# EasyEDA Pro project stc8g.eprj

# Schematic Schematic1
Board Name: Board1; Create Date: 2024-12-19; Page Name: P1; Project Name: stc8g; Schematic Name: Schematic1; Update Date: 2024-12-22; Company: 嘉立创EDA; Page Size: A4; Version: V1.0
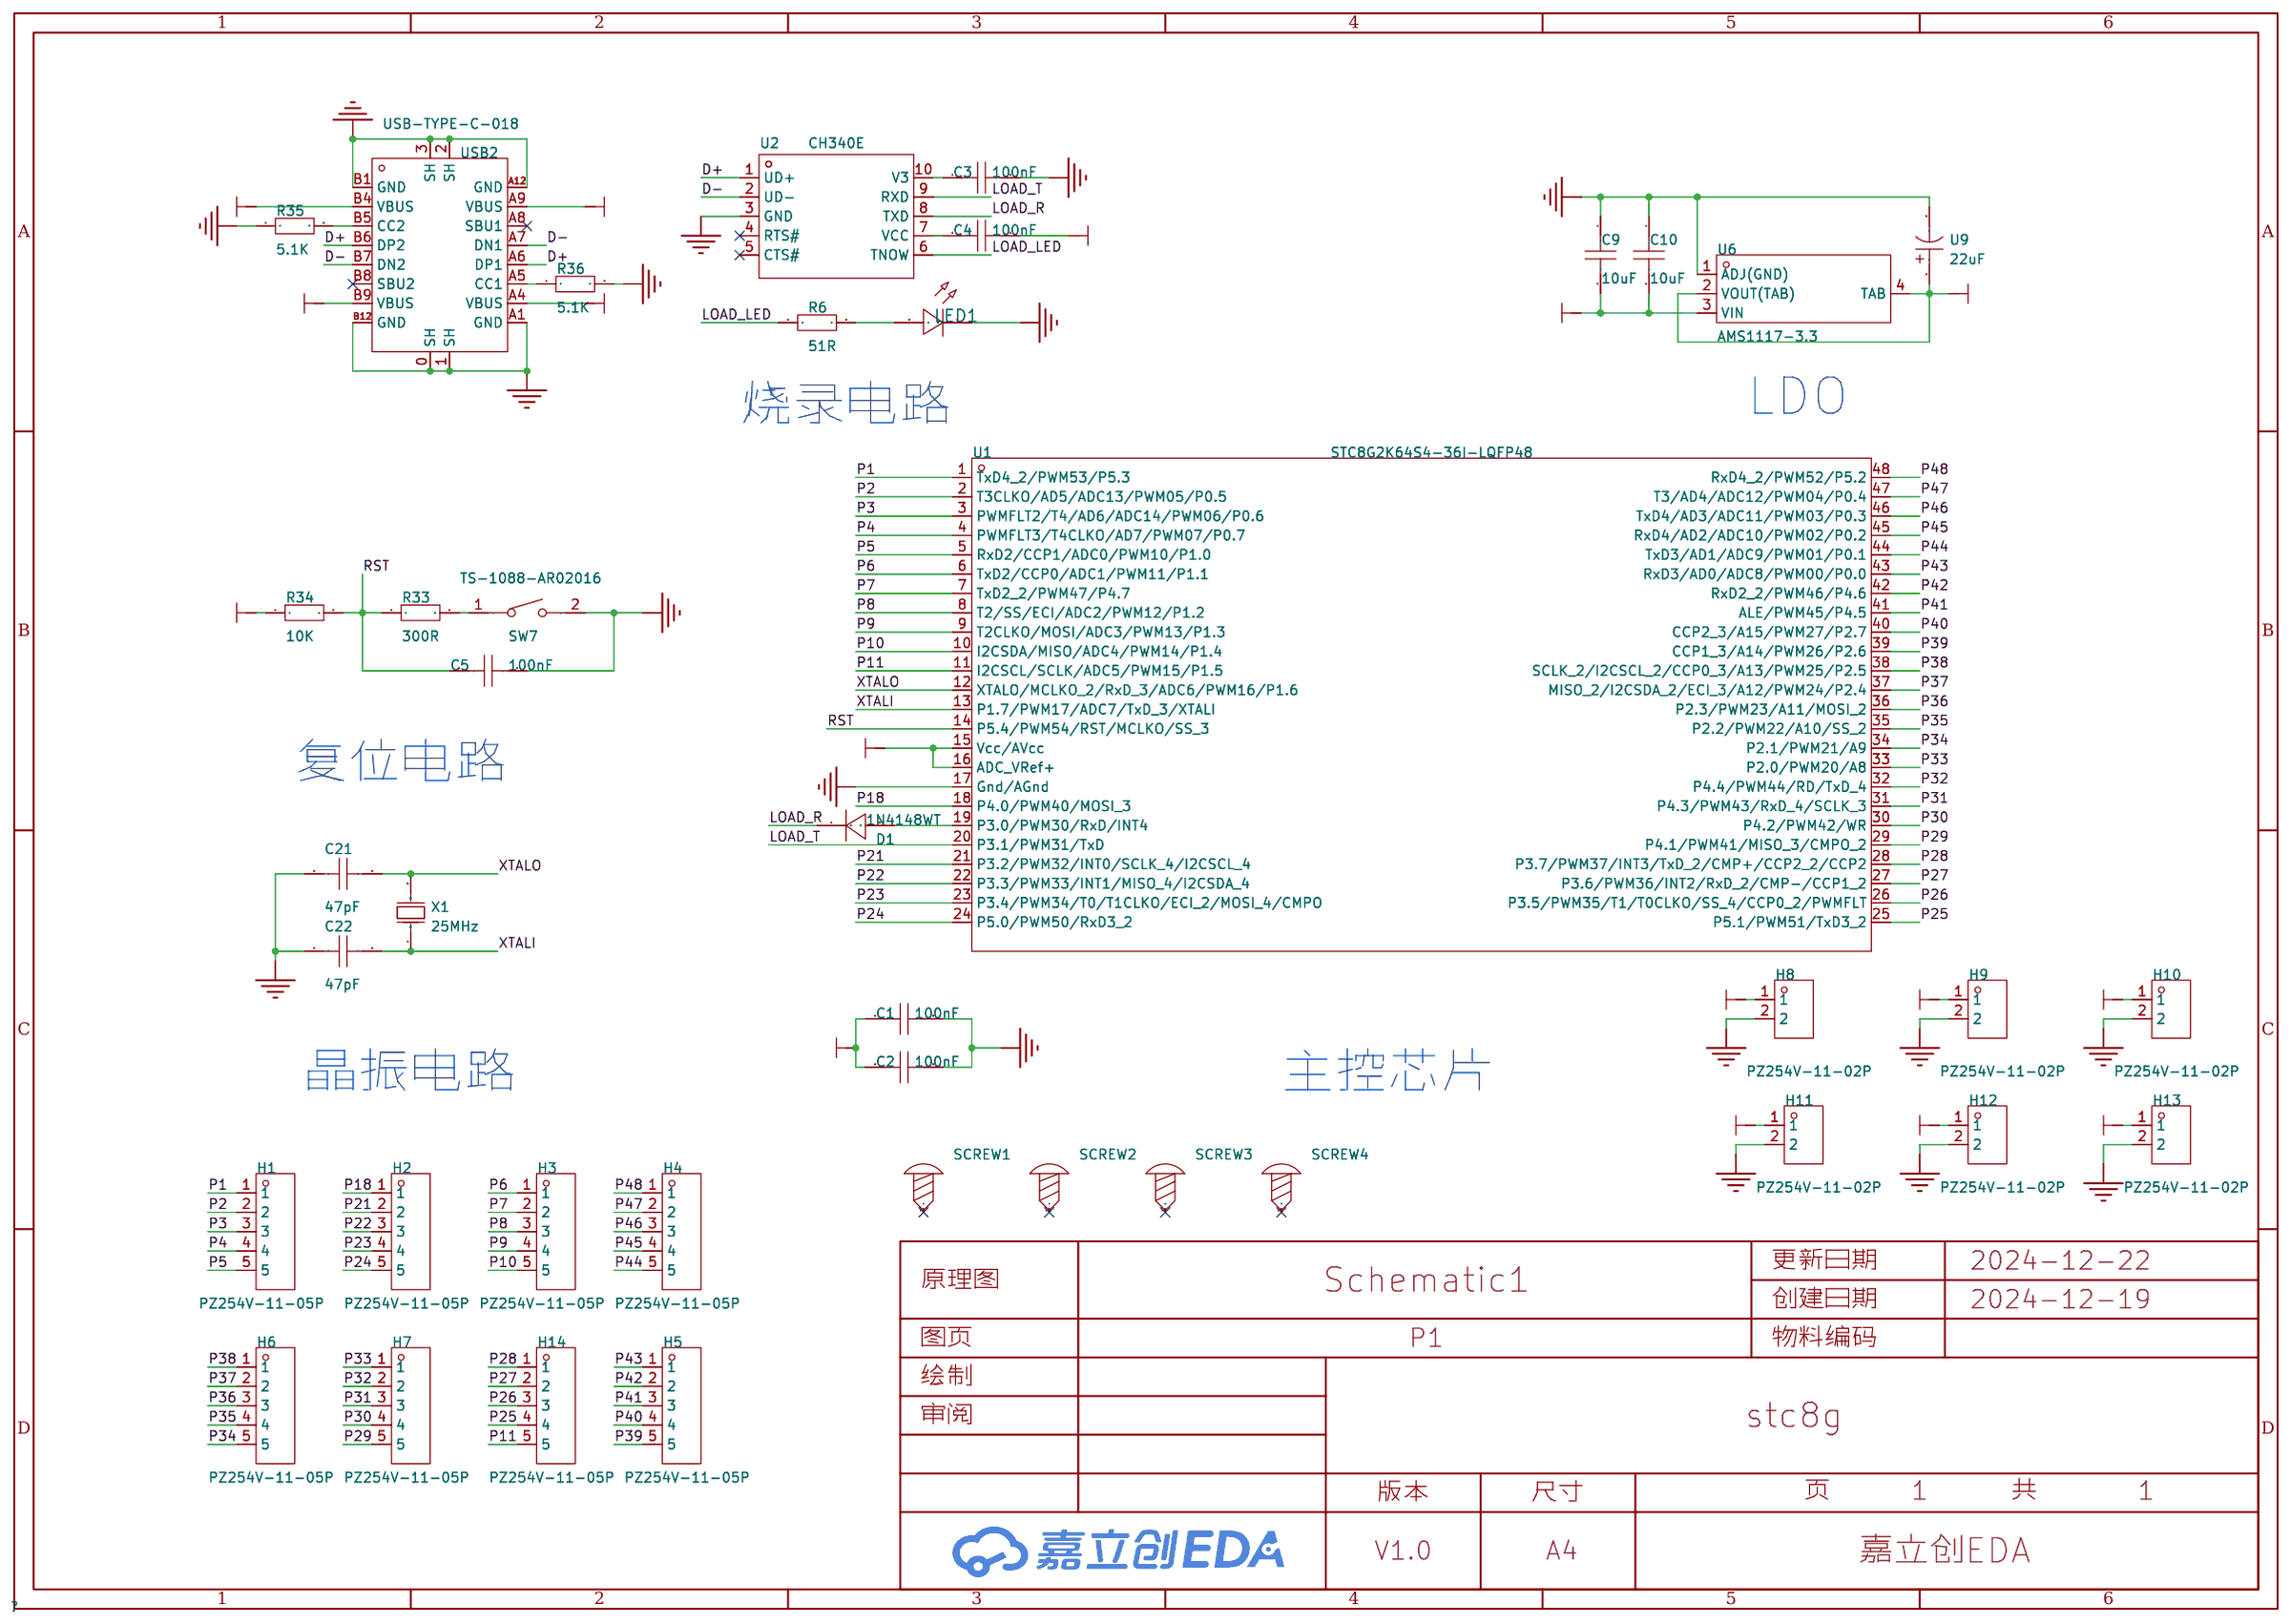
[diagram p0: schematic sheet]

## Parts
C1  100nF  [C0603]
C2  100nF  [C0603]
C3  100nF  [C0603]
C4  100nF  [C0603]
C5  100nF  [C0603]
C9  10uF  [C0603]
C10  10uF  [C0603]
C21  47pF  [C0603]
C22  47pF  [C0603]
D1  1N4148WT  [SOD-523_L1.2-W0.8-LS1.6-RD]
H1  PZ254V-11-05P  [HDR-TH_5P-P2.54-V-M]
H2  PZ254V-11-05P  [HDR-TH_5P-P2.54-V-M]
H3  PZ254V-11-05P  [HDR-TH_5P-P2.54-V-M]
H4  PZ254V-11-05P  [HDR-TH_5P-P2.54-V-M]
H5  PZ254V-11-05P  [HDR-TH_5P-P2.54-V-M]
H6  PZ254V-11-05P  [HDR-TH_5P-P2.54-V-M]
H7  PZ254V-11-05P  [HDR-TH_5P-P2.54-V-M]
H8  PZ254V-11-02P  [HDR-TH_2P-P2.54-V-M]
H9  PZ254V-11-02P  [HDR-TH_2P-P2.54-V-M]
H10  PZ254V-11-02P  [HDR-TH_2P-P2.54-V-M]
H11  PZ254V-11-02P  [HDR-TH_2P-P2.54-V-M]
H12  PZ254V-11-02P  [HDR-TH_2P-P2.54-V-M]
H13  PZ254V-11-02P  [HDR-TH_2P-P2.54-V-M]
H14  PZ254V-11-05P  [HDR-TH_5P-P2.54-V-M]
LED1  -  [LED_0603]
R6  51R  [R0603]
R33  300R  [R0603]
R34  10K  [R0603]
R35  5.1K  [R0603]
R36  5.1K  [R0603]
SCREW1  -  [M2螺丝]
SCREW2  -  [M2螺丝]
SCREW3  -  [M2螺丝]
SCREW4  -  [M2螺丝]
SW7  TS-1088-AR02016  [SW-SMD_L3.9-W3.0-P4.45]
U1  STC8G2K64S4-36I-LQFP48  [LQFP-48_L7.0-W7.0-P0.50-LS9.0-BL]
U2  CH340E  [MSOP-10_L3.0-W3.0-P0.50-LS5.0-BL]
U6  AMS1117-3.3  [SOT-223-4_L6.5-W3.5-P2.30-LS7.0-BR]
U9  22uF  [CAP-SMD_L2.0-W1.3-FD]
USB2  USB-TYPE-C-018  [USB-C_SMD-TYPE-C-31-M-12]
X1  25MHz  [CRYSTAL-SMD_2P-L5.0-W3.2]

## Library data of the parts
C1-C5 C9 C10 C21 C22 = CAP_0603: Supplier Footprint: 0603
D1 = 1N4148WT_C232841: 二极管配置:独立式;正向压降(Vf):1V@10mA;直流反向耐压(Vr):75V;平均整流电流(Io):300mA;功率:200mW;反向恢复时间(trr):4ns;; LCSC Part Name: 电压:75V 电流:300mA; Supplier Part: C232841; Manufacturer: onsemi(安森美); Supplier Footprint: SOD-523F; JLCPCB Part Class: 扩展库; Datasheet: https://atta.szlcsc.com/upload/public/pdf/source/20181222/C232841_42C5BA49E5A441BB8F6B91D0F4CD0D51.pdf; Supplier: LCSC; Diode Configuration: 独立式; Forward Voltage (Vf@If): 1V@10mA; Reverse Voltage (Vr): 75V; Average Rectified Current (Io): 300mA; Power Dissipation: 200mW; Reverse Leakage Current: 5uA@75V; Reverse Recovery Time (trr): 4ns; Operating Temperature: -55℃~+150℃@(Tj)
H1-H7 H14 = PZ254V-11-05P: LCSC Part Name: 间距:2.54mm 1x5P 直插 方针; Supplier Part: C492404; Manufacturer: XFCN(兴飞); Supplier Footprint: 插件,P=2.54mm; JLCPCB Part Class: 扩展库; Datasheet: https://atta.szlcsc.com/upload/public/pdf/source/20200309/C492404_E51533260F8710EFF5D4617281164C1D.pdf; Supplier: LCSC; Pin Structure: 1x5P; Pitch: 2.54mm; Circluar Pins/Square Pins: 方针; Mounting Type: 直插; Number of Rows: 单排; Number of Pins: 5P; Length of Mating Pin: 6mm; Insulation Height: 2.5mm; Length of End Connection Pin: 3mm; Contact Material: 黄铜; Operating Temperature Range: -40℃~+105℃; Color: 黑色
H8-H13 = PZ254V-11-02P: LCSC Part Name: 间距:2.54mm 1x2P 直插 方针; Supplier Part: C492401; Manufacturer: XFCN(兴飞); Supplier Footprint: 插件,P=2.54mm; JLCPCB Part Class: 扩展库; Datasheet: https://atta.szlcsc.com/upload/public/pdf/source/20200309/C492401_A812433581A9B211A7FFA413ADDFF0E5.pdf; Supplier: LCSC; Pin Structure: 1x2P; Pitch: 2.54mm; Circluar Pins/Square Pins: 方针; Mounting Type: 直插; Number of Rows: 单排; Number of Pins: 2P; Length of Mating Pin: 6mm; Insulation Height: 2.5mm; Length of End Connection Pin: 3mm; Contact Material: 黄铜; Operating Temperature Range: -40℃~+105℃; Color: 黑色
LED1 = LED_0603-R: Supplier Footprint: 0603
R6 R33-R36 = Res_0603: Supplier Footprint: 0603
SCREW1-SCREW4 = M2螺丝: Supplier Footprint: 插件
SW7 = TS-1088-AR02016: 电路结构:单刀单掷;按钮形状:圆形按钮;作用力:160gf;安装方式:立贴;开关长度:4mm;开关宽度:3mm;开关高度:2mm;带支架:不带;触点电流:50mA;额定电压(DC):12V;绝缘电阻:100MΩ;机械寿命:10万次;; LCSC Part Name: 4*3*2mm 立贴 轻触开关; Supplier Part: C720477; Manufacturer: XUNPU(讯普); Supplier Footprint: SMD; JLCPCB Part Class: 扩展库; Datasheet: https://atta.szlcsc.com/upload/public/pdf/source/20200810/C720475_60D09DD6C54279ADDB2DC25100F1CC11.pdf; Supplier: LCSC; Circuit: 单刀单掷; Actuator Style: 圆形按钮; Operating Force: 160gf; Mounting Style: 立贴; Switch Length: 4mm; Switch Width: 3mm; Switch Height: 2mm; Strike Gundam: 不带; Contact Current: 50mA; Voltage Rating (DC): 12V; Insulation Resistance: 100MΩ; Actuator/Cap Color: 黑色; Pin Style: SMD接片; Mechanical Life: 10万次; Operating Temperature: -30℃~+80℃
U1 = STC8G2K64S4-36I-LQFP48: CPU内核:51系列;程序存储容量:64KB;RAM总容量:2.25KB;GPIO端口数量:45;工作电压范围:1.9V~5.5V;CPU最大主频:-;程序存储器类型:FLASH;; Supplier Part: C915668; Manufacturer: STC(宏晶); Supplier Footprint: LQFP-48(7x7); JLCPCB Part Class: 扩展库; Datasheet: https://atta.szlcsc.com/upload/public/pdf/source/20230914/7707908C45C6343AE73767C1466DDB8D.pdf; Supplier: LCSC; CPU Core: 51系列; Program Storage Size: 64KB; RAM Size: 2.25KB; GPIO Ports Number: 45; Operating Voltage Range: 1.9V~5.5V; Program Memory Type: FLASH; Operating Temperature Range: -40℃~+85℃; ADC (Bit): 10bit; PWM (Bit): 15bit; 16Bit Timer: 5; UART/USART: 4; I2C: 1; SPI: 1; Internal Comparator: 有; Peripheral/Function: 低电压检测；看门狗；CCP捕获/比较；除法器；乘法器; Watchdog: 有; Low-Voltage Detect: 有; CCP Capture/Compare: 有; Internal Oscillator: 有
U2 = CH340E: 应用功能:收发器;接口协议:USB 2.0;数据速率:2Mbps;; LCSC Part Name: USB转串口芯片 CH340; Supplier Part: C99652; Manufacturer: WCH(南京沁恒); Supplier Footprint: MSOP-10; JLCPCB Part Class: 扩展库; Datasheet: https://atta.szlcsc.com/upload/public/pdf/source/20230530/6E401E9554E9F5311886CC8B3F89B62E.pdf; Supplier: LCSC; Applications Function: 收发器; Protocol: USB 2.0; Supply Voltage: 3.3V；5V; Data Rate: 2Mbps
U6 = AMS1117-3.3_C347222: 输出类型:固定;最大输入电压:18V;输出电压:3.3V;输出电流:1A;电源纹波抑制比(PSRR):60dB@(120Hz);输出极性:正极;; LCSC Part Name: 输出:3.3V 电流:1A 耐压:12V; Supplier Part: C347222; Manufacturer: UMW(友台半导体); Supplier Footprint: SOT-223; JLCPCB Part Class: 扩展库; Datasheet: https://atta.szlcsc.com/upload/public/pdf/source/20231109/155D79A26D9DB04352555A58D5969DC8.pdf; Supplier: LCSC; Output Type: 固定; Maximum Input Voltage: 18V; Output Voltage: 3.3V; Output Current: 1A; Power Supply Rejection Ratio (PSRR): 60dB@(120Hz); Dropout Voltage: 1.3V@(1A); Feature: 过流保护(OCP); Output Polarity: 正极; Number of Outputs: 1
U9 = TMCP0J226MTRF: 容值:22uF;精度:±20%;额定电压:6.3V;等效串联电阻:5.9Ω@100kHz;; LCSC Part Name: 22uF ±20% 6.3V; Supplier Part: C4983891; Manufacturer: VISHAY(威世); Supplier Footprint: 0805; JLCPCB Part Class: 扩展库; Datasheet: https://atta.szlcsc.com/upload/public/pdf/source/20231213/45DEC9D623A3BCD604D80B89FE3D1B4C.pdf; Supplier: LCSC; Tolerance: ±20%; Rated Voltage: 6.3V; Equivalent Series Resistance(ESR): 5.9Ω@100kHz; Operating Temperature: -55℃~+125℃
USB2 = USB-TYPE-C-018: 连接器类型:Type-C;标准:-;公母:母;安装方式:卧贴;触点数量:16P;端口数量:1;额定电流 - 电源:3A;工作温度范围:-25℃~+85℃;; LCSC Part Name: Type-C 母 卧贴; Supplier Part: C2927038; Manufacturer: DEALON(德艺隆); Supplier Footprint: SMD; JLCPCB Part Class: 扩展库; Datasheet: https://atta.szlcsc.com/upload/public/pdf/source/20211217/CCD3D517E355E8E0CC52ABD8D5784AD8.pdf; Supplier: LCSC; Connector Type: Type-C; Gender: 母; Mounting Style: 卧贴; Number of Contacts: 16P; Number of Ports: 1; Current Rating - Power (Max): 3A; Operating Temperature Range: -25℃~+85℃
X1 = XG1EL89CSI-111YLC-25M: 晶振类型:贴片晶振;频率:25MHz;常温频差:±10ppm;外接负载电容:20pF;频率稳定度(全温):±20ppm;; LCSC Part Name: 25MHz ±10ppm 20pF; Supplier Part: C7471626; Manufacturer: YXC(扬兴晶振); Supplier Footprint: SMD5032; JLCPCB Part Class: 扩展库; Datasheet: https://atta.szlcsc.com/upload/public/pdf/source/20240329/44922B0AF7B60E58E9B66993B6077277.pdf; Supplier: LCSC; Crystal Type: 贴片晶振; Normal temperature Frequency Tolerance: ±10ppm; External load capacitor: 20pF; Frequency Stability(Full temperature range): ±20ppm; Operating Temperature: -40℃~+85℃

## Nets
3V3: C1.1 C2.1 H8.1 H9.1 H10.1 H11.1 H12.1 H13.1 R34.1 U1.15(Vcc/AVcc) U1.16(ADC_VRef+) U6.2(VOUT(TAB)) U6.4(TAB) U9.1
GND: C1.2 C2.2 C3.2 C5.1 C9.1 C10.1 C21.1 C22.1 H8.2 H9.2 H10.2 H11.2 H12.2 H13.2 LED1.1(C) R35.1 R36.2 SW7.2 U1.17(Gnd/AGnd) U2.3(GND) U6.1(ADJ(GND)) U9.2 USB2.0(SH) USB2.1(SH) USB2.2(SH) USB2.3(SH) USB2.A1(GND) USB2.A12(GND) USB2.B1(GND) USB2.B12(GND)
VBUS: C4.1 C9.2 C10.2 U6.3(VIN) USB2.A4(VBUS) USB2.A9(VBUS) USB2.B4(VBUS) USB2.B9(VBUS)
D+: U2.1(UD+) USB2.A6(DP1) USB2.B6(DP2)
D-: U2.2(UD-) USB2.A7(DN1) USB2.B7(DN2)
LOAD_LED: R6.1 U2.6(TNOW)
LOAD_R: D1.1(C) U2.8(TXD)
LOAD_T: U1.20(P3.1/PWM31/TxD) U2.9(RXD)
P1: H1.1 U1.1(TxD4_2/PWM53/P5.3)
P2: H1.2 U1.2(T3CLKO/AD5/ADC13/PWM05/P0.5)
P3: H1.3 U1.3(PWMFLT2/T4/AD6/ADC14/PWM06/P0.6)
P4: H1.4 U1.4(PWMFLT3/T4CLKO/AD7/PWM07/P0.7)
P5: H1.5 U1.5(RxD2/CCP1/ADC0/PWM10/P1.0)
P6: H3.1 U1.6(TxD2/CCP0/ADC1/PWM11/P1.1)
P7: H3.2 U1.7(TxD2_2/PWM47/P4.7)
P8: H3.3 U1.8(T2/SS/ECI/ADC2/PWM12/P1.2)
P9: H3.4 U1.9(T2CLKO/MOSI/ADC3/PWM13/P1.3)
P10: H3.5 U1.10(I2CSDA/MISO/ADC4/PWM14/P1.4)
P11: H14.5 U1.11(I2CSCL/SCLK/ADC5/PWM15/P1.5)
P18: H2.1 U1.18(P4.0/PWM40/MOSI_3)
P21: H2.2 U1.21(P3.2/PWM32/INT0/SCLK_4/I2CSCL_4)
P22: H2.3 U1.22(P3.3/PWM33/INT1/MISO_4/I2CSDA_4)
P23: H2.4 U1.23(P3.4/PWM34/T0/T1CLKO/ECI_2/MOSI_4/CMPO)
P24: H2.5 U1.24(P5.0/PWM50/RxD3_2)
P25: H14.4 U1.25(P5.1/PWM51/TxD3_2)
P26: H14.3 U1.26(P3.5/PWM35/T1/T0CLKO/SS_4/CCP0_2/PWMFLT)
P27: H14.2 U1.27(P3.6/PWM36/INT2/RxD_2/CMP-/CCP1_2)
P28: H14.1 U1.28(P3.7/PWM37/INT3/TxD_2/CMP+/CCP2_2/CCP2)
P29: H7.5 U1.29(P4.1/PWM41/MISO_3/CMPO_2)
P30: H7.4 U1.30(P4.2/PWM42/WR)
P31: H7.3 U1.31(P4.3/PWM43/RxD_4/SCLK_3)
P32: H7.2 U1.32(P4.4/PWM44/RD/TxD_4)
P33: H7.1 U1.33(P2.0/PWM20/A8)
P34: H6.5 U1.34(P2.1/PWM21/A9)
P35: H6.4 U1.35(P2.2/PWM22/A10/SS_2)
P36: H6.3 U1.36(P2.3/PWM23/A11/MOSI_2)
P37: H6.2 U1.37(MISO_2/I2CSDA_2/ECI_3/A12/PWM24/P2.4)
P38: H6.1 U1.38(SCLK_2/I2CSCL_2/CCP0_3/A13/PWM25/P2.5)
P39: H5.5 U1.39(CCP1_3/A14/PWM26/P2.6)
P40: H5.4 U1.40(CCP2_3/A15/PWM27/P2.7)
P41: H5.3 U1.41(ALE/PWM45/P4.5)
P42: H5.2 U1.42(RxD2_2/PWM46/P4.6)
P43: H5.1 U1.43(RxD3/AD0/ADC8/PWM00/P0.0)
P44: H4.5 U1.44(TxD3/AD1/ADC9/PWM01/P0.1)
P45: H4.4 U1.45(RxD4/AD2/ADC10/PWM02/P0.2)
P46: H4.3 U1.46(TxD4/AD3/ADC11/PWM03/P0.3)
P47: H4.2 U1.47(T3/AD4/ADC12/PWM04/P0.4)
P48: H4.1 U1.48(RxD4_2/PWM52/P5.2)
RST: C5.2 R33.1 R34.2 U1.14(P5.4/PWM54/RST/MCLKO/SS_3)
XTALI: C22.2 U1.13(P1.7/PWM17/ADC7/TxD_3/XTALI) X1.1(OSC1)
XTALO: C21.2 U1.12(XTALO/MCLKO_2/RxD_3/ADC6/PWM16/P1.6) X1.2(OSC2)
$1N465: D1.2(A) U1.19(P3.0/PWM30/RxD/INT4)
$1N938: R33.2 SW7.1
$1N1407: C3.1 U2.10(V3)
$1N1408: C4.2 U2.7(VCC)
$1N1412: LED1.2(A) R6.2
$1N1428: R36.1 USB2.A5(CC1)
$1N1430: R35.2 USB2.B5(CC2)

Not connected (* = marked no-connect by the designer): SCREW1 1*; SCREW2 1*; SCREW3 1*; SCREW4 1*; U2 4(RTS#)* 5(CTS#)*; USB2 A8(SBU1)* B8(SBU2)*

## Notes on the sheet
- 烧录电路
- LDO
- 复位电路
- 晶振电路
- 主控芯片

# Board PCB1
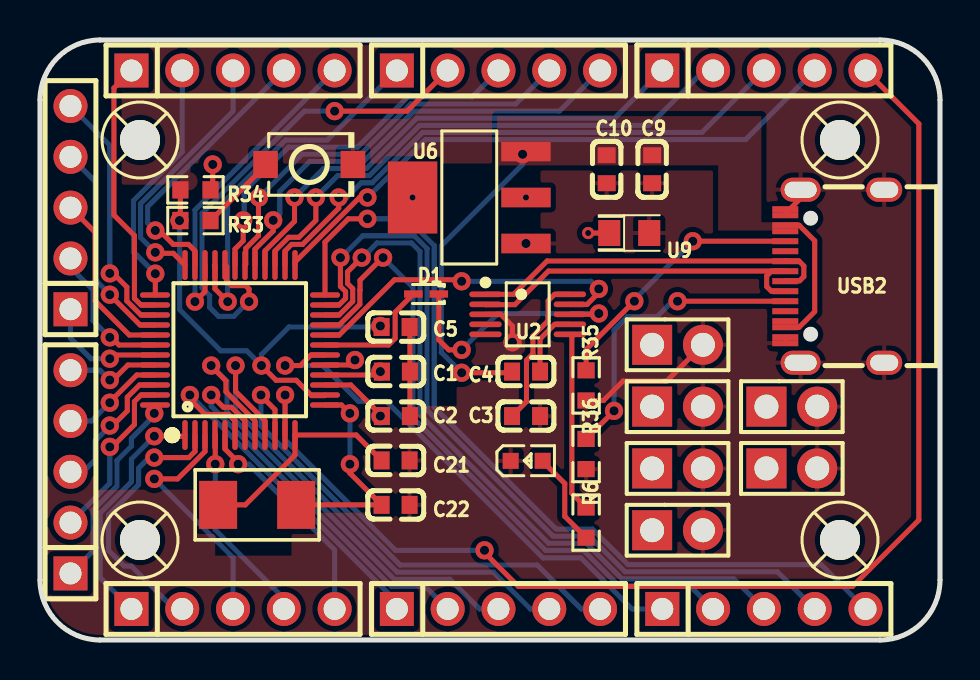
[diagram p1: board, top side]
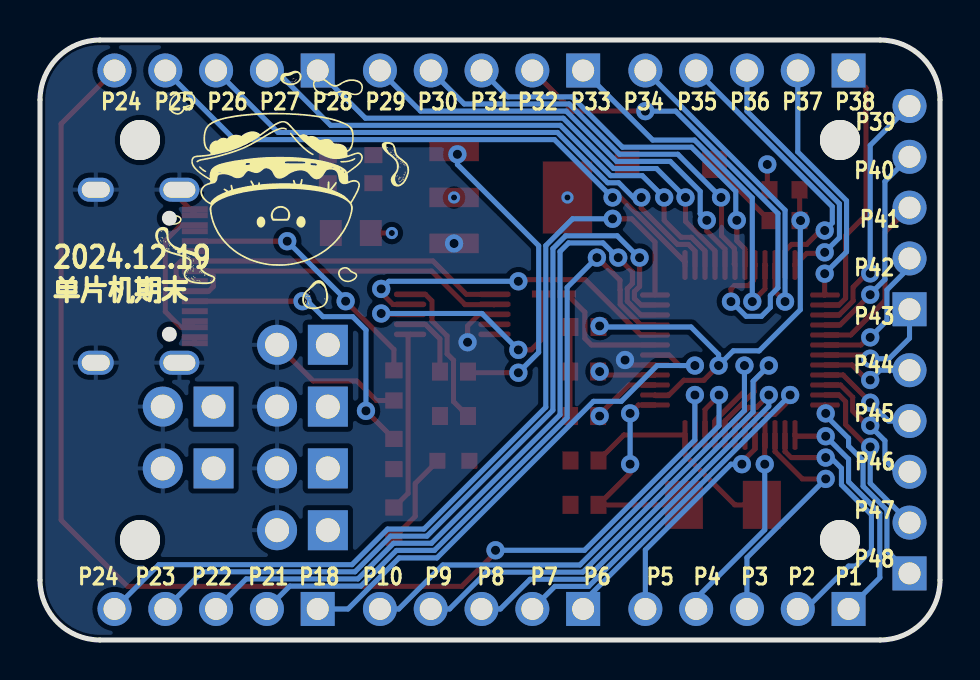
[diagram p2: board, bottom side, seen from below]

Outline 45 x 30 mm; copper layers: Top Layer, Inner1, Inner2, Bottom Layer. Coordinates in mm from the lower left corner of the outline.
Outline path: 0,27 0,3 arc(0.88,0.88) 3,0 42,0 arc(44.12,0.88) 45,3 45,27 arc(44.12,29.12) 42,30 3,30 arc(0.88,29.12) 0,27
Stack: Top Layer 0.035mm 外层铜厚1oz / Dielectric1 0.2104mm 7628 RC49% 8.6mil / Inner1 0.0152mm 内层铜厚 / Dielectric2 1.065mm 1.1mm H/HOZ Copper / Inner2 0.0152mm 内层铜厚 / Dielectric3 0.2104mm 7628 RC49% 8.6mil / Bottom Layer 0.035mm 外层铜厚1oz

## Design rules (mm)
net D+: DP1
net D-: DP1
template: JLCPCB Capability(Two Layers Board)
spacing copperThickness1oz (default): track to track 0.102, other pairs 0.152 to 0.3
spacing copperThickness2oz: track to track 0.203, other pairs 0.152 to 0.3
track width copperThickness1oz (default): min 0.127, default 0.254, max 2.54
track width copperThickness2oz: min 0.203, default 0.254, max 2.54
differential pair differentialPair (default): width min 0.127, default 0.254, max 2.54; gap min 0.152, default 0.152
via viaSize (default): diameter min 0.5, default 0.61, max 10; hole min 0.3, default 0.305, max 6.3

## Placement (name value [footprint] x y rotation side)
C1  100nF  [C0603]  17.8 13.42 0 top
C2  100nF  [C0603]  17.8 11.2 0 top
C3  100nF  [C0603]  24.3 11.2 0 top
C4  100nF  [C0603]  24.3 13.42 0 top
C5  100nF  [C0603]  17.78 15.65 180 top
C9  10uF  [C0603]  30.61 23.54 90 top
C10  10uF  [C0603]  28.34 23.54 90 top
C21  47pF  [C0603]  17.78 8.98 180 top
C22  47pF  [C0603]  17.78 6.76 180 top
D1  1N4148WT  [SOD-523_L1.2-W0.8-LS1.6-RD]  19.3 17.3 180 top
H1  PZ254V-11-05P  [HDR-TH_5P-P2.54-V-M]  9.65 1.55 0 top
H2  PZ254V-11-05P  [HDR-TH_5P-P2.54-V-M]  36.19 1.55 0 top
H3  PZ254V-11-05P  [HDR-TH_5P-P2.54-V-M]  22.92 1.55 0 top
H4  PZ254V-11-05P  [HDR-TH_5P-P2.54-V-M]  1.52 8.41 90 top
H5  PZ254V-11-05P  [HDR-TH_5P-P2.54-V-M]  1.52 21.62 90 top
H6  PZ254V-11-05P  [HDR-TH_5P-P2.54-V-M]  9.65 28.48 0 top
H7  PZ254V-11-05P  [HDR-TH_5P-P2.54-V-M]  22.92 28.48 0 top
H8  PZ254V-11-02P  [HDR-TH_2P-P2.54-V-M]  31.88 5.49 0 top
H9  PZ254V-11-02P  [HDR-TH_2P-P2.54-V-M]  31.88 11.67 0 top
H10  PZ254V-11-02P  [HDR-TH_2P-P2.54-V-M]  31.88 8.58 0 top
H11  PZ254V-11-02P  [HDR-TH_2P-P2.54-V-M]  31.88 14.76 0 top
H12  PZ254V-11-02P  [HDR-TH_2P-P2.54-V-M]  37.59 8.58 0 top
H13  PZ254V-11-02P  [HDR-TH_2P-P2.54-V-M]  37.59 11.67 0 top
H14  PZ254V-11-05P  [HDR-TH_5P-P2.54-V-M]  36.19 28.48 0 top
LED1  -  [LED_0603]  24.38 8.97 0 top
R6  51R  [R0603]  27.31 5.87 270 top
R33  300R  [R0603]  7.77 20.97 0 top
R34  10K  [R0603]  7.77 22.51 180 top
R35  5.1K  [R0603]  27.31 12.73 90 top
R36  5.1K  [R0603]  27.31 9.3 270 top
SCREW1  -  [M2螺丝]  5 25 0 top
SCREW2  -  [M2螺丝]  5 5 0 top
SCREW3  -  [M2螺丝]  40 25 0 top
SCREW4  -  [M2螺丝]  40 5 0 top
SW7  TS-1088-AR02016  [SW-SMD_L3.9-W3.0-P4.45]  13.46 23.78 0 top
U1  STC8G2K64S4-36I-LQFP48  [LQFP-48_L7.0-W7.0-P0.50-LS9.0-BL]  10 14.5 0 top
U2  CH340E  [MSOP-10_L3.0-W3.0-P0.50-LS5.0-BL]  24.38 16.28 270 top
U6  AMS1117-3.3  [SOT-223-4_L6.5-W3.5-P2.30-LS7.0-BR]  21.46 22.13 0 top
U9  22uF  [CAP-SMD_L2.0-W1.3-FD]  29.46 20.35 0 top
USB2  USB-TYPE-C-018  [USB-C_SMD-TYPE-C-31-M-12]  39.74 18.19 90 top
X1  25MHz  [CRYSTAL-SMD_2P-L5.0-W3.2]  10.86 6.76 180 top

## Footprints (pads in the part's own frame, mm; a bottom-side part is the same pattern mirrored in y, then rotated)
C0603
  rect 0.8x0.9 smd: 1(-0.7,0) 2(0.7,0)
CAP-SMD_L2.0-W1.3-FD
  rect 1.1x1.3 smd: 1(-1,0) 2(1,0)
CRYSTAL-SMD_2P-L5.0-W3.2
  rect 1.9x2.4 smd: 1(-1.95,0) 2(1.95,0)
HDR-TH_2P-P2.54-V-M
  rect 2x2 hole 1.2: 1(-1.27,0)
  round 2 hole 1.2: 2(1.27,0)
HDR-TH_5P-P2.54-V-M
  rect 1.7x1.7 hole 1.1: 1(-5.08,0)
  round 1.7 hole 1.1: 2(-2.54,0) 3(0,0) 4(2.54,0) 5(5.08,0)
LED_0603
  rect 0.8x0.8 smd: 1(-0.851,-0.01) 2(0.75,-0.005)
LQFP-48_L7.0-W7.0-P0.50-LS9.0-BL
  oval 0.27x1.5 smd: 1(-2.75,-4.25) 2(-2.25,-4.25) 3(-1.75,-4.25) 4(-1.25,-4.25) 5(-0.75,-4.25) 6(-0.25,-4.25) 7(0.25,-4.25) 8(0.75,-4.25) 9(1.25,-4.25) 10(1.75,-4.25) 11(2.25,-4.25) 12(2.75,-4.25) 25(2.75,4.25) 26(2.25,4.25) 27(1.75,4.25) 28(1.25,4.25) 29(0.75,4.25) 30(0.25,4.25) 31(-0.25,4.25) 32(-0.75,4.25) 33(-1.25,4.25) 34(-1.75,4.25) 35(-2.25,4.25) 36(-2.75,4.25)
  oval 1.5x0.27 smd: 13(4.25,-2.75) 14(4.25,-2.25) 15(4.25,-1.75) 16(4.25,-1.25) 17(4.25,-0.75) 18(4.25,-0.25) 19(4.25,0.25) 20(4.25,0.75) 21(4.25,1.25) 22(4.25,1.75) 23(4.25,2.25) 24(4.25,2.75) 37(-4.25,2.75) 38(-4.25,2.25) 39(-4.25,1.75) 40(-4.25,1.25) 41(-4.25,0.75) 42(-4.25,0.25) 43(-4.25,-0.25) 44(-4.25,-0.75) 45(-4.25,-1.25) 46(-4.25,-1.75) 47(-4.25,-2.25) 48(-4.25,-2.75)
M2螺丝
  round 2 hole 2: 1(0,0)
MSOP-10_L3.0-W3.0-P0.50-LS5.0-BL
  oval 0.28x1.62 smd: 1(-1,-2.11) 2(-0.5,-2.11) 3(0,-2.11) 4(0.5,-2.11) 5(1,-2.11) 6(1,2.11) 7(0.5,2.11) 8(0,2.11) 9(-0.5,2.11) 10(-1,2.11)
R0603
  rect 0.806x0.864 smd: 1(-0.753,0) 2(0.753,0)
SOD-523_L1.2-W0.8-LS1.6-RD
  rect 0.93x0.36 smd: 1(-0.635,0) 2(0.635,0)
SOT-223-4_L6.5-W3.5-P2.30-LS7.0-BR
  rect 2.47x0.98 smd: 1(2.835,-2.3) 2(2.835,0) 3(2.835,2.3)
  rect 2.47x3.6 smd: 4(-2.835,0)
SW-SMD_L3.9-W3.0-P4.45
  rect 1.23x1.36 smd: 1(-2.185,0) 2(2.185,0)
USB-C_SMD-TYPE-C-31-M-12
  oval 1.2x2 hole 0.8x1.6: 0(-4.325,1.706) 1(4.325,1.706)
  oval 1.2x1.8 hole 0.8x1.4: 2(4.325,-2.474) 3(-4.325,-2.474)
  rect 0.3x1.3 smd: A1(-3.35,2.474) A4(-2.55,2.474) A5(-1.25,2.474) A6(-0.25,2.474) A7(0.25,2.474) A8(1.25,2.474) A9(2.55,2.474) A12(3.35,2.474) B1(3.05,2.474) B4(2.25,2.474) B5(1.75,2.474) B6(0.75,2.474) B7(-0.75,2.474) B8(-1.75,2.474) B9(-2.25,2.474) B12(-3.05,2.474)

## Nets
As in the schematic.

Pads without a net: SCREW1 1; SCREW2 1; SCREW3 1; SCREW4 1; U2 4 5; USB2 A8 B8

## Via types
v1: diameter 0.914, hole 0.457, Top Layer to Bottom Layer, 61 vias
v2: diameter 0.61, hole 0.305, Top Layer to Bottom Layer, 3 vias

## Routing (per net, layer and track width the routed paths; a pad name or vN(x,y) marks a point on that pad's centre or on a via; arc(x,y) is an arc through that point)
3V3: length 8.8
  Top Layer w0.254: U1.16 16.93,13.25 C1.1 ; R34.1 8.64,22.62 v1(8.64,23.78) ; U9.1 v2(27.41,20.35) ; U1.15 15.54,12.75 C2.1
  vias: v1(17.02,13.42) v1(17.02,11.2) v2(18.63,22.13) v2(24.3,22.13)
GND: length 17.3
  Top Layer w0.254: v1(23.62,14.89) 23.62,15.7 23.04,16.28 U2.3 ; C2.2 C1.2 18.5,15.63 C5.1 ; U1.17 15.5,13.75 v1(15.75,14) ; R35.1 28.18,11.97 29.15,12.95 31.34,12.95 H11.2 ; USB2.1 38.03,22.08 37.26,21.32 ; USB2.B12 USB2.A1
  vias: v1(24.3,19.83)
VBUS: length 22.7
  Top Layer w0.254: v1(21.08,13.36) 23.54,13.36 C4.1 ; USB2.A4 37.96,15.64 38.74,16.42 38.74,19.96 37.96,20.74 37.26,20.74
  Bottom Layer w0.254: v1(21.08,13.36) 20.07,14.38 20.07,19.71 24.13,23.78 v1(24.13,24.28)
D+: length 18.3
  Top Layer w0.254: USB2.A6 37.29,17.96 37.98,17.96 38.19,18.17 38.19,18.7 37.95,18.95 37.28,18.95 USB2.B6 37.25,18.95 25.35,18.95 23.69,17.28 U2.1
D-: length 18.3
  Top Layer w0.254: U2.2 22.29,16.77 23.74,16.77 25.42,18.45 37.09,18.45 37.09,18.44 ; 37.09,18.44 37.26,18.44 USB2.A7 37.09,18.44 37.09,18.44 ; 37.09,18.44 36.57,18.44 36.33,18.2 36.33,17.67 36.57,17.44 USB2.B7
LOAD_LED: length 9
  Top Layer w0.254: R6.1 26.59,7.33 26.59,15.18 U2.6
LOAD_R: length 12.7
  Top Layer w0.254: v1(27.94,16.33) 27.9,16.28 U2.8 ; v1(21.08,14.51) 20.44,14.51 19.94,15.01 D1.1
  Bottom Layer w0.254: v1(27.94,16.33) 22.9,16.33 v1(21.08,14.51)
LOAD_T: length 16.9
  Top Layer w0.254: v1(27.94,17.55) 27.94,17.37 27.35,16.78 26.5,16.78 U2.9 ; v1(21.08,17.94) 21,18.01 17.72,18.01 14.96,15.25 U1.20
  Bottom Layer w0.254: v1(27.94,17.55) 27.56,17.94 v1(21.08,17.94)
P1: length 12
  Top Layer w0.254: U1.1 7.19,10.19 v1(5.72,10.19)
  Bottom Layer w0.254: v1(5.72,10.19) 4.57,9.05 4.57,7.91 3.01,6.35 3.01,3.11 H1.1
P2: length 13.6
  Top Layer w0.254: v1(5.72,9.12) 7.44,9.12 7.75,9.43 U1.2
  Bottom Layer w0.254: v1(5.72,9.12) 5.46,9.12 4.93,8.59 4.93,7.76 3.43,6.26 3.43,4.48 4.21,3.7 4.57,3.7 6.71,1.55 H1.2
P3: length 12.1
  Top Layer w0.254: U1.3 8.25,9.43 6.88,8.06 v1(5.72,8.06)
  Bottom Layer w0.254: H1.3 9.65,4.12 v1(5.72,8.06)
P4: length 10.1
  Top Layer w0.254: v1(8.76,8.79) 8.76,10.24 U1.4
  Bottom Layer w0.254: H1.4 12.19,2.08 8.76,5.51 v1(8.76,8.79)
P5: length 11.3
  Top Layer w0.254: v1(9.91,8.79) 9.91,8.89 9.25,9.55 U1.5
  Bottom Layer w0.254: v1(9.91,8.79) 10.45,8.79 14.73,4.51 H1.5
P6: length 18.4
  Top Layer w0.254: U1.6 9.75,10.95 9.42,11.28 8.25,11.28 7.57,11.97 7.49,11.97
  Bottom Layer w0.254: H3.1 17.84,1.9 v1(7.49,12.25)
P7: length 19.5
  Top Layer w0.254: U1.7 10.25,10.95 9.57,11.64 9.17,11.64 v1(8.56,12.25)
  Bottom Layer w0.254: H3.2 19.25,2.68 17.57,2.68 8.56,11.69 v1(8.56,12.25)
P8: length 24.6
  Top Layer w0.254: 8.58,13.65 8.61,13.65 9.3,12.96 9.3,12.41 10.75,10.96 U1.8
  Bottom Layer w0.254: H3.3 21.98,1.55 20.5,3.04 17.71,3.04 9.34,11.41 9.34,12.94 v1(8.56,13.72)
P9: length 26.1
  Top Layer w0.254: 9.78,13.65 9.78,12.43 11.25,10.96 U1.9
  Bottom Layer w0.254: H3.4 24.52,1.55 22.68,3.39 17.86,3.39 9.78,11.48 v1(9.78,13.72)
P10: length 24.6
  Top Layer w0.254: U1.10 11.75,11.52 11.05,12.22 v1(11.05,12.25)
  Bottom Layer w0.254: H3.5 27.06,1.55 24.86,3.75 18.01,3.75 11.05,10.71 v1(11.05,12.25)
P11: length 63.9
  Top Layer w0.254: v1(22.22,4.48) 22.22,4.37 23.91,2.68 40.63,2.68 43.94,6 43.94,25.81 H14.5 ; U1.11 12.25,12.18
  Bottom Layer w0.254: v1(12.26,12.25) 12.26,12.25 12.26,10 17.78,4.48 v1(22.22,4.48)
P18: length 26.1
  Top Layer w0.254: U1.18 13.55,14.25 13.02,13.72 v1(12.26,13.72)
  Bottom Layer w0.254: 31.12,1.55 29.6,1.55 27.05,4.11 25.15,4.11 17.32,11.93 15.93,11.93 14.14,13.72 v1(12.26,13.72)
P21: length 32.6
  Top Layer w0.254: U1.21 14.96,15.75 15.99,16.78 15.99,17.49 16,17.5 16,17.99 17.13,19.12 v1(17.15,19.12)
  Bottom Layer w0.254: H2.2 32.51,2.7 28.96,2.7 27.18,4.48 25.28,4.48 18.64,11.12 18.64,17.63 v1(17.15,19.12)
P22: length 37
  Top Layer w0.254: U1.22 14.95,16.25 15.63,16.93 15.63,17.57 15.38,17.83 15.38,18.41 v1(16.09,19.12)
  Bottom Layer w0.254: 16.09,19.25 16.32,19.25 16.42,19.35 16.42,19.42 16.85,19.85 18.57,19.85 19,19.42 19,11.26 25.43,4.84 27.32,4.84 29.11,3.05 34.69,3.05 H2.3
P23: length 40.1
  Top Layer w0.254: 15.02,19.25 15.02,17.68 15.28,17.42 15.28,17.08 14.95,16.75 U1.23
  Bottom Layer w0.254: 38.74,1.55 36.88,3.41 29.25,3.41 27.47,5.19 25.65,5.19 19.35,11.49 19.35,19.57 18.72,20.21 16.14,20.21 15.05,19.12 v1(15.02,19.12)
P24: length 42.7
  Top Layer w0.254: 16.13,21.06 15.41,21.06 14.25,19.9 U1.24
  Bottom Layer w0.254: H2.5 39.06,3.77 29.4,3.77 27.62,5.55 25.8,5.55 19.71,11.64 19.71,19.72 18.37,21.06 v1(16.37,21.06)
P25: length 29.9
  Top Layer w0.254: U1.25 12.75,18.9 15.98,22.13 16.13,22.13
  Bottom Layer w0.254: v1(16.37,22.13) 16.38,22.13 19.28,25.02 35.28,25.02 38.74,28.48
P26: length 28.7
  Top Layer w0.254: v1(14.94,22.13) 14.94,21.59 13.13,19.78 12.58,19.78 12.25,19.45 U1.26
  Bottom Layer w0.254: H14.3 33.1,25.38 19.13,25.38 16.62,22.86 16.07,22.86 15.33,22.13 v1(14.94,22.13)
P27: length 27
  Top Layer w0.254: U1.27 11.75,19.45 12.43,20.14 12.95,20.14 13.79,20.98 v1(13.79,22.13)
  Bottom Layer w0.254: v1(13.79,22.13) 14.88,23.22 16.47,23.22 18.98,25.73 30.47,25.73 33.21,28.48 H14.2
P28: length 25
  Top Layer w0.254: v1(12.73,22.13) 12.73,20.93 11.25,19.46 U1.28
  Bottom Layer w0.254: 31.12,28.48 28.73,26.09 18.84,26.09 16.32,23.57 14.17,23.57 v1(12.73,22.13)
P29: length 22.7
  Top Layer w0.254: U1.29 10.75,19.54 11.66,20.45 v1(11.66,20.98)
  Bottom Layer w0.254: v1(11.66,20.98) 11.99,21.31 11.99,22.43 13.49,23.93 16.17,23.93 18.69,26.44 25.97,26.44 H7.5
P30: length 20.8
  Top Layer w0.254: U1.30 10.29,18.79 10.29,19.58 10.92,20.22 10.92,22.1 10.9,22.13
  Bottom Layer w0.254: H7.4 23.79,26.8 18.54,26.8 16.03,24.29 13.11,24.29 v1(10.95,22.13)
P31: length 19
  Top Layer w0.254: 10.16,20.86 10.16,19.96 9.75,19.55 U1.31
  Bottom Layer w0.254: H7.3 21.6,27.16 18.39,27.16 15.88,24.64 12.42,24.64 10.21,22.43 10.21,21.03 v1(10.16,20.98)
P32: length 25.3
  Top Layer w0.254: v1(10.45,16.92) 10.45,17.55 10.28,17.72 9.58,17.72 9.34,17.96 9.34,18.66 U1.32 ; H7.2 18.35,26.44 v1(14.73,26.44)
  Bottom Layer w0.254: v1(14.73,26.44) 13.22,26.44 8.1,21.33 8.1,17.6 8.48,17.22 8.48,16.63 8.93,16.18 9.69,16.18 10.17,16.67 10.2,16.67 v1(10.45,16.92)
P33: length 18.4
  Top Layer w0.254: U1.33 8.72,18.72 8.75,18.69 8.75,17.55 v1(9.38,16.92)
  Bottom Layer w0.254: v1(9.38,16.92) 9.38,22.11 12.28,25 14.37,25 H7.1
P34: length 16.5
  Top Layer w0.254: U1.34 8.25,17.42 v1(7.75,16.92)
  Bottom Layer w0.254: H6.5 7.75,21.49 v1(7.75,16.92)
P35: length 13.9
  Top Layer w0.254: U1.35 7.75,19.45 7.42,19.78 6.66,19.78 5.97,20.47
  Bottom Layer w0.254: H6.4 5.38,21.67 5.38,20.86 v1(5.77,20.47)
P36: length 13
  Top Layer w0.254: U1.36 6.67,19.33 5.84,19.33
  Bottom Layer w0.254: H6.3 9.65,26.44 5.03,21.82 5.03,20.12 v1(5.77,19.38)
P37: length 12.7
  Top Layer w0.254: U1.37 5.77,17.27 v1(5.77,18.32)
  Bottom Layer w0.254: v1(5.77,18.32) 4.67,19.41 4.67,21.96 7.11,24.4 H6.2
P38: length 13.3
  Top Layer w0.254: H6.1 3.7,27.6 3.7,21.25 4.72,20.22 4.72,17.08 5.05,16.75 U1.38
P39: length 12.6
  Top Layer w0.254: U1.39 5.05,16.25 4.34,16.95 4.34,17.65 3.66,18.33 3.63,18.33
  Bottom Layer w0.254: H5.5 3.49,24.73 v1(3.49,18.33)
P40: length 10.6
  Top Layer w0.254: v1(3.49,17.26) 5,15.75 U1.40
  Bottom Layer w0.254: v1(3.49,17.26) 3.49,17.29 2.75,18.03 2.75,22.93 H5.4
P41: length 8.9
  Top Layer w0.254: U1.41 4.46,15.25 2.75,16.96 2.75,20.39 H5.3
P42: length 7
  Top Layer w0.254: U1.42 3.95,14.75 3.72,14.99 ; 3.57,14.99 3.57,14.86
  Bottom Layer w0.254: v1(3.49,15.13) 2.65,15.97 2.65,17.5 1.52,18.63 H5.2
P43: length 6.1
  Top Layer w0.254: U1.43 3.71,14.25 3.52,14.06
  Bottom Layer w0.254: v1(3.49,14.06) 2.55,14.06 1.52,15.09 H5.1
P44: length 4.7
  Top Layer w0.254: U1.44 4.4,13.75 3.65,13 3.53,13
  Bottom Layer w0.254: H4.5 3,13.49 v1(3.49,13)
P45: length 5.2
  Top Layer w0.254: U1.45 4.84,13.25 3.58,11.99 3.58,11.86
  Bottom Layer w0.254: v1(3.49,11.86) 2.58,10.95 H4.4
P46: length 6.9
  Top Layer w0.254: 3.63,10.72 4.37,11.45 4.37,12.14 4.97,12.75 U1.46
  Bottom Layer w0.254: v1(3.49,10.72) 3.49,10.7 2.75,9.96 2.75,9 2.16,8.41 H4.3
P47: length 8.5
  Top Layer w0.254: 3.68,9.66 3.68,9.73 4.72,10.77 4.72,11.92 5.05,12.25 U1.47
  Bottom Layer w0.254: H4.2 3.49,7.84 v1(3.49,9.66)
P48: length 10.2
  Top Layer w0.254: U1.48 5.72,11.72 v1(5.72,11.33)
  Bottom Layer w0.254: H4.1 2.65,4.46 2.65,6.5 3.85,7.69 3.85,8.97 4.57,9.7 4.57,10.09 5.72,11.23 v1(5.72,11.33)
RST: length 22.1
  Top Layer w0.254: U1.14 14.22,12.22 13.58,12.22 12.81,12.99 11.81,12.99 v1(11.07,13.72) ; R34.2 R33.1
  Bottom Layer w0.254: v1(6.97,20.97) 6.99,20.96 6.99,16.51 9.04,14.46 10.33,14.46 v1(11.07,13.72) 11.07,14.27 12.45,15.65 16.97,15.65 v1(17.02,15.7)
XTALI: length 10.7
  Top Layer w0.254: U1.13 15.07,11.75 v1(15.49,11.33) ; v1(15.49,8.79) 15.49,8.34 C22.2 X1.1
  Bottom Layer w0.254: v1(15.49,11.33) 15.49,9.05
XTALO: length 10.7
  Top Layer w0.254: C21.2 15.81,10.25 U1.12 12.75,9.25 10.26,6.76 X1.2
$1N465: length 6.2
  Top Layer w0.254: D1.2 17.76,16.39 17.76,15.08 17.43,14.75 U1.19
$1N938: length 3.9
  Top Layer w0.254: SW7.1 11.28,23.72 R33.2
$1N1407: length 7.7
  Top Layer w0.254: C3.1 24.32,11.92 24.32,13.99 24.65,14.31 24.65,15.2 25.4,15.96 25.4,16.19 25.41,16.19 25.41,16.96 25.73,17.28 U2.10
$1N1408: length 3.4
  Top Layer w0.254: U2.7 25.73,15.78 25,15.06 C4.2
$1N1412: length 4.7
  Top Layer w0.254: LED1.2 25.13,8.93 26.24,7.83 26.24,6.18 R6.2
$1N1428: length 15.2
  Top Layer w0.254: v1(28.7,11.46) 28.7,11.45 R36.1 ; USB2.A5 v1(31.88,16.94)
  Bottom Layer w0.254: v1(28.7,11.46) 28.7,15.5 29.36,16.17 30.85,16.17 31.62,16.94 v1(31.88,16.94)
$1N1430: length 13.3
  Top Layer w0.254: R35.2 27.31,14.53 v1(29.72,16.94) ; USB2.B5 v1(32.64,19.94)
  Bottom Layer w0.254: v1(29.72,16.94) 29.72,17.02 v1(32.64,19.94)

## Copper pours and planes (outline as drawn; the poured copper is in the pictures)
3V3 on Inner1: 0.26,29.74 44.74,29.74 44.74,0.26 0.26,0.26
GND on Top Layer: -2.41,31.52 48.64,31.52 48.64,-2.77 -2.41,-2.77
GND on Bottom Layer: -2.67,32.67 50.29,32.67 50.29,-4.16 -2.67,-4.16
GND on Inner2: 0.26,29.74 44.74,29.74 44.74,0.26 0.26,0.26
VBUS on Top Layer: 22.86,26.19 37.79,26.19 37.79,20.47 22.86,20.47

Small or netless copper shapes (teardrops, artwork), in the pictures only: 17 on Inner1, 34 on Inner2

## Text on the board
Bottom Silkscreen Layer: P41 | P39 | P46 | P40 | P42 | P43 | P45 | P47 | P48 | P44 | P38 | P1 | P2 | P37 | P3 | P36 | P4 | P35 | P5 | P34 | P6 | P33 | P7 | P32 | P8 | P31 | P9 | P30 | P29 | P10 | P28 | P18 | P27 | P21 | P26 | P22 | P25 | P23 | P24 | 2024.12.19 / 单片机期末
